# Altium schematic sheet Bopit_final2.SchDoc
size 420 x 297 mm; SheetNumber: 1; SheetTotal: 1
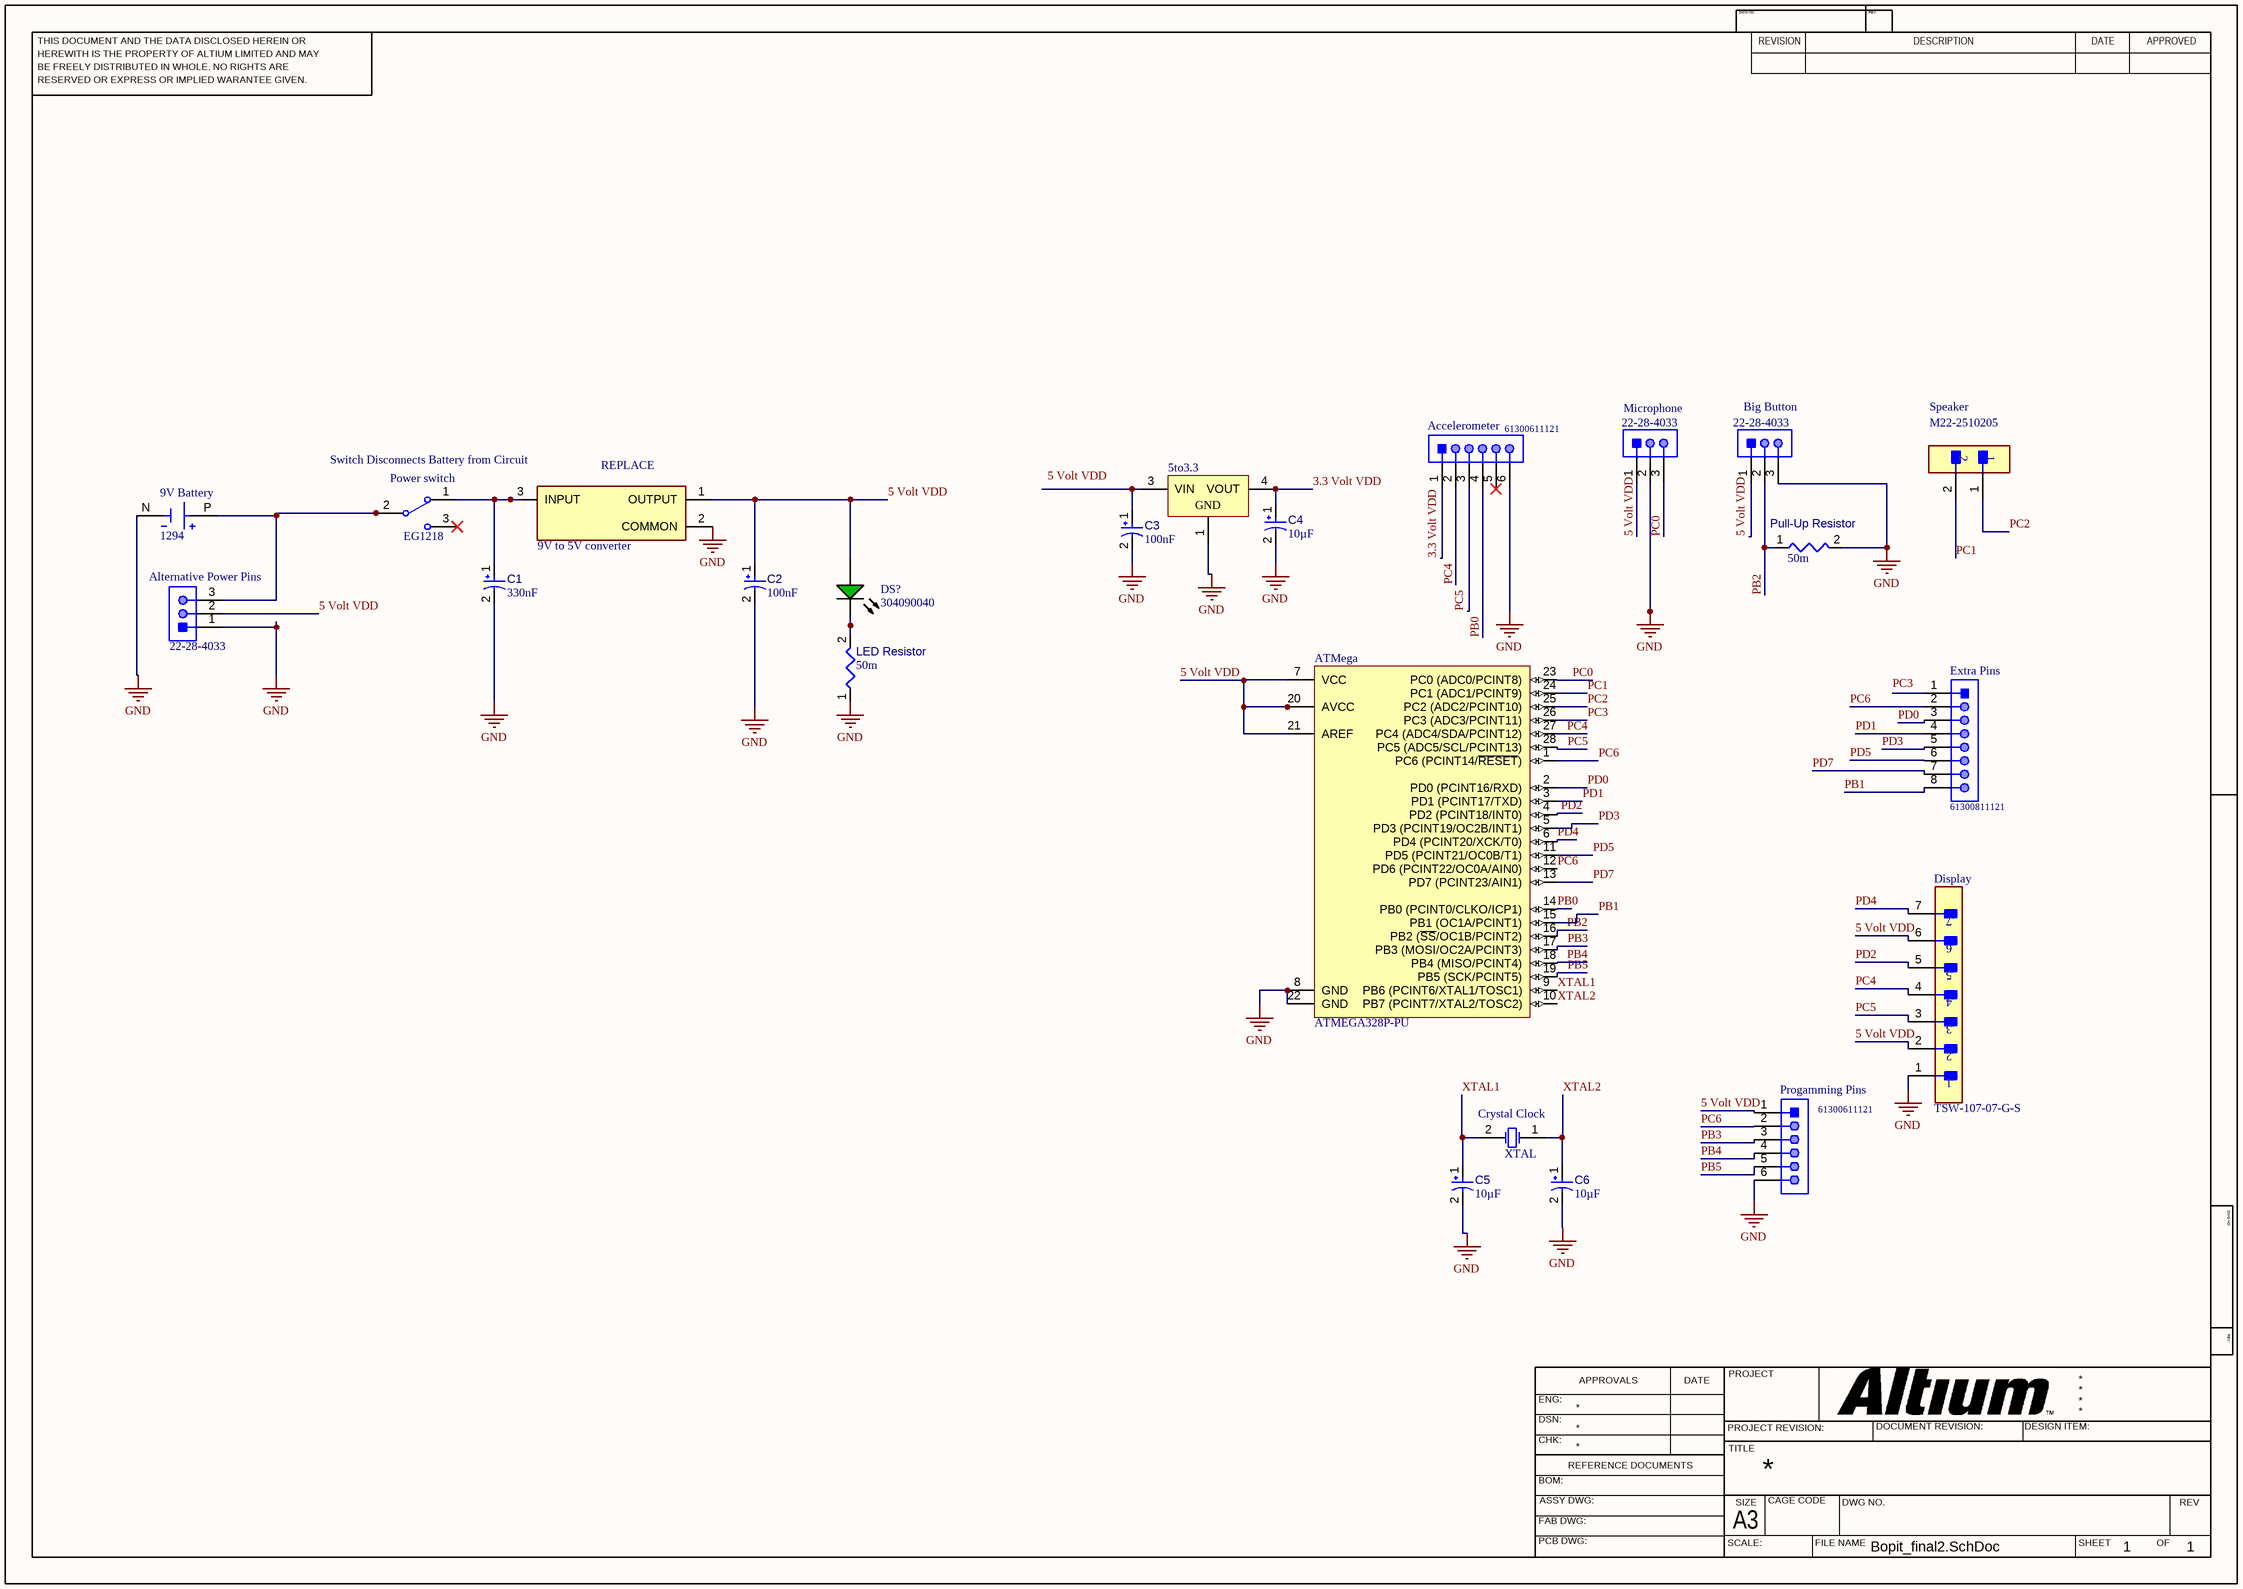
[diagram p0: Bopit_final2.SchDoc]

## Parts
5to3.3  LD1117DT33TR  [TO-252_N]  (value not drawn)
9V_Battery  1294  [BAT_1294]
9V_to_5V_converter  UA78L05CPK  [FP-PK0003A-MFG]  (value not drawn)
Accelerometer  61300611121  [61300611121]
Alternative_Power_Pins  22-28-4033  [MOLX-22-28-4033_V]
ATMega  ATMEGA328P-PU  [ATML-28P3]
Big_Button  22-28-4033  [MOLX-22-28-4033_V]
C1  value 330nF  [CAPPR55-200-1100X500X1200]  (hidden comment: ECA-1HHG010)
C2  value 100nF  [CAPPR55-200-1100X500X1200]  (hidden comment: ECA-1HHG010)
C3  value 100nF  [CAPPR55-200-1100X500X1200]  (hidden comment: ECA-1HHG010)
C4  value 10µF  [CAPPR55-200-1100X500X1200]  (hidden comment: ECA-1HHG010)
C5  value 10µF  [CAPPR55-200-1100X500X1200]  (hidden comment: ECA-1HHG010)
C6  value 10µF  [CAPPR55-200-1100X500X1200]  (hidden comment: ECA-1HHG010)
Crystal_Clock  XTAL  [R38]
Display  TSW-107-07-G-S  [FP-TSW-107-07-G-S-MFG]
DS?  304090040  [LED-2P-2.28-3MM]
Extra_Pins  61300811121  [61300811121]
LED_Resistor  value 50m  [RESA86-1060X240]  (hidden comment: 12FR050E)
Microphone  22-28-4033  [MOLX-22-28-4033_V]
Power_switch  EG1218  [ESWI-EG1218_V]
Progamming_Pins  61300611121  [61300611121]
Pull-Up_Resistor  value 50m  [RESA86-1060X240]  (hidden comment: 12FR050E)
Speaker  M22-2510205  [FP-M22-2510205-MFG]

## Nets
GND: 5to3.3.1(GND) 9V_Battery.N(NEG) 9V_to_5V_converter.2(COMMON) Accelerometer.6 Alternative_Power_Pins.1 ATMega.8(GND) ATMega.22(GND) Big_Button.3 C1.2 C2.2 C3.2 C4.2 C5.2 C6.2 Display.1 LED_Resistor.1 Microphone.2 Progamming_Pins.6 Pull-Up_Resistor.2
3.3 Volt VDD: 5to3.3.4(VOUT) Accelerometer.1 C4.1
5 Volt VDD: 9V_to_5V_converter.1(OUTPUT) Alternative_Power_Pins.2 ATMega.7(VCC) ATMega.20(AVCC) ATMega.21(AREF) Big_Button.1 C2.1 Display.2 Display.6 DS?.1(A) Microphone.1 Progamming_Pins.1
PB0: Accelerometer.4 ATMega.14(PB0_(PCINT0/CLKO/ICP1))
PB1: ATMega.15(PB1_(OC1A/PCINT1)) Extra_Pins.8
PB2: ATMega.16(PB2_(~{SS}/OC1B/PCINT2)) Big_Button.2 Pull-Up_Resistor.1
PB3: ATMega.17(PB3_(MOSI/OC2A/PCINT3)) Progamming_Pins.3
PB4: ATMega.18(PB4_(MISO/PCINT4)) Progamming_Pins.4
PB5: ATMega.19(PB5_(SCK/PCINT5)) Progamming_Pins.5
PC0: ATMega.23(PC0_(ADC0/PCINT8)) Microphone.3
PC1: ATMega.24(PC1_(ADC1/PCINT9)) Speaker.2
PC2: ATMega.25(PC2_(ADC2/PCINT10)) Speaker.1
PC3: ATMega.26(PC3_(ADC3/PCINT11))
PC4: Accelerometer.2 ATMega.27(PC4_(ADC4/SDA/PCINT12)) Display.4
PC5: Accelerometer.3 ATMega.28(PC5_(ADC5/SCL/PCINT13)) Display.3
PC6: ATMega.1(PC6_(PCINT14/~{RESET})) ATMega.12(PD6_(PCINT22/OC0A/AIN0)) Extra_Pins.2 Progamming_Pins.2
PD0: ATMega.2(PD0_(PCINT16/RXD)) Extra_Pins.3
PD1: ATMega.3(PD1_(PCINT17/TXD)) Extra_Pins.4
PD2: ATMega.4(PD2_(PCINT18/INT0)) Display.5
PD3: ATMega.5(PD3_(PCINT19/OC2B/INT1)) Extra_Pins.5
PD4: ATMega.6(PD4_(PCINT20/XCK/T0)) Display.7
PD5: ATMega.11(PD5_(PCINT21/OC0B/T1)) Extra_Pins.6
PD7: ATMega.13(PD7_(PCINT23/AIN1)) Extra_Pins.7
XTAL1: ATMega.9(PB6_(PCINT6/XTAL1/TOSC1)) C5.1 Crystal_Clock.2(OSC2)
XTAL2: ATMega.10(PB7_(PCINT7/XTAL2/TOSC2)) C6.1 Crystal_Clock.1(OSC1)
Net5to3.3_3: 5to3.3.3(VIN) C3.1
Net9V_Battery_P: 9V_Battery.P(POS) Alternative_Power_Pins.3 Power_switch.2(COM)
Net9V_to_5V_converter_3: 9V_to_5V_converter.3(INPUT) C1.1 Power_switch.1
NetDS?_2: DS?.2(K) LED_Resistor.2

Not connected (* = marked no-connect by the designer): Accelerometer 5*; Extra_Pins 1; Power_switch 3*

## Notes on the sheet
- Switch Disconnects Battery from Circuit
- (near 9V_to_5V_converter) REPLACE
- Labels drawn without touching a wire or pin: 5 Volt VDD, PC3
- THIS DOCUMENT AND THE DATA DISCLOSED HEREIN OR
- HEREWITH IS THE PROPERTY OF ALTIUM LIMITED AND MAY
- DWG NO:
- REVISION
- REV:
- DESCRIPTION
- DATE
- APPROVED
- BE FREELY DISTRIBUTED IN WHOLE. NO RIGHTS ARE
- RESERVED OR EXPRESS OR IMPLIED WARANTEE GIVEN.
- ENG:
- APPROVALS
- PROJECT
- DSN:
- CHK:
- REFERENCE DOCUMENTS
- PROJECT REVISION:
- TITLE
- DOCUMENT REVISION:
- DESIGN ITEM:
- BOM:
- FAB DWG:
- PCB DWG:
- ASSY DWG:
- SCALE:
- A3
- SIZE
- CAGE CODE
- FILE NAME
- DWG NO.
- SHEET
- OF
- REV

## Library data of the parts
5to3.3 = CMP-0244-00088-1: Fixed Low Drop Positive Voltage Regulator, 3.3V, 3-Pin DPAK, Tape and Reel; ComponentLink1Description: Manufacturer URL; PackageVersion: 2011; PackageReference: TO-252; ComponentLink2Description: Datasheet; ComponentLink1URL: http://www.st.com; DatasheetVersion: 1/11/2011; PackageDescription: 3-Pin Transistor Outline Package 2.28 mm Pitch, 9.7 mm Lead Span (DPAK); ComponentLink2URL: http://www.st.com/internet/com/TECHNICAL_RESOURCES/TECHNICAL_LITERATURE/DATASHEET/CD00000544.pdf
9V_Battery = 1294: Battery Holder _Open_ 9V 1 Cell PC Pin; MF: Adafruit Industries; Availability: Unavailable; Value: *; Package: None; MP: 1294; Price: None; SnapEDA_Link: https://www.snapeda.com/parts/1294/Adafruit%20Industries/view-part/891197/?ref=snap
9V_to_5V_converter = CMP-2000-07341-2: IC REG LINEAR 5V 100MA SOT89-3; Manufacturer: Texas Instruments; Min Supply Voltage: 7V; Accuracy Percentage: 3.75%; Dropout Voltage: 1.7V; Number Of Outputs: 1; Nominal Supply Current: 3.8mA; Max Supply Voltage: 20V; Output Type: Fixed; Max Junction Temp: +125°C; Digikey Description: IC REG LINEAR 5V 100MA SOT89-3; RoHS: TRUE; ComponentLink2URL: https://www.ti.com/lit/ds/symlink/ua78l.pdf; Package: PK0003A; Temperature Range High: +125°C; Device Class L2: Power Management ICs; Manufacturer Part Number: UA78L05CPK; ComponentLink2Description: Datasheet; Category: IC; Lead Free: Yes; Automotive: No; Temperature Range Low: 0°C; Output Current: 100mA; Mouser Description: 100-mA, 30-V VIN, Positive-Voltage Linear Regulators 3-SOT-89 0 to 125; Device Class L3: Voltage Regulators - Linear; Device Class L1: Integrated Circuits (ICs); Temperature: 0°C to +125°C; Output Voltage: 5V; Height: 1.6mm; Octopart: https://octopart.com/ua78l05cpk-texas+instruments-525289
Accelerometer Progamming_Pins = CMP-1502-01070-1: THT Vertical Pin Header WR-PHD, Pitch 2.54 mm, Single Row, 6 pins; Manufacturer: Wurth Elektronik; Gender: Male; Pin Number: 6; Pitch: 2.54mm; Working Voltage: 250VAC; Rated Current: 3A; Withstanding Voltage: 500VAC; Contact Resistance: 20mOhm; Operating Temperature: -40to105degC; Packaging: Bag; Datasheet URL: https://katalog.we-online.de/em/datasheet/6130xx11121.pdf; Package Reference: 61300611121; Mounting Technology: THT; Publisher: WurthElektronik; Part Number: 61300611121; Manufacturer URL: http://www.we-online.de; Row Number: Single; Orientation: Vertical
Alternative_Power_Pins Big_Button Microphone = CMP-1676-00001-5: Male Header, Pitch 2.54 mm, 1 x 3 Position, Height 8.38 mm, Tail Length 3.18 mm, RoHS, Bulk; Manufacturer: Molex; Rows: 1; Voltage Rating: 250 V; Current Rating: 4 A; Min Operating Temperature: 0 degC; Lead Pitch: 0.1 inch; Packaging: Bulk; Contact Finish: Gold; RoHSCompliant: true; Contact Material: Brass; PackageReference: 22-28-4033; REACH SVHC: Unknown; PackageDescription: Male Header, Pitch 2.54 mm, 1 x 3 Position, Height 8.38 mm, Tail Length 3.18 mm; ComponentLink2URL: http://www.molex.com/pdm_docs/sd/022284033_sd.pdf; Height: 8.38 mm; Mounting Technology: Through Hole; ComponentLink1Description: Manufacturer URL; Length: 7.62 mm; Mount: Through Hole; DatasheetVersion: Rev. G, 01/2012; Max Operating Temperature: 75 degC; ComponentLink2Description: Datasheet; Colour: Black; Pins: 3; Contact Plating: Gold; Package Quantity: 1; ComponentLink1URL: http://www.molex.com/
ATMega = CMP-020-00004-2: 8-Bit Microcontroller with 32 KBytes In-System Programmable Flash, 23 I/Os, -40 to 85 degC, 28-Pin PDIP (28P3), RoHS, Tube; Manufacturer: Atmel; Max Supply Voltage: 5.5V; Density: 32KB; Package Version: Rev. B, 09/2001; Max Clock Frequency: 20MHz; I/Os: 23; Ethernet Channels: 0; Min Supply Voltage: 1.8V; RAM Size: 2KB; Interface: USART; Case/Package: DIP; Packaging: Rail/Tube; Datasheet Version: Rev. 8271J, 11/2015; Max Operating Temperature: 85°C; Datasheet URL: http://www.atmel.com/images/Atmel-8271-8-bit-AVR-Microcontroller-ATmega48A-48PA-88A-88PA-168A-168PA-328-328P_datasheet_Complete.pdf; Package Reference: 28P3; Package URL: http://www.atmel.com/images/Atmel-8271-8-bit-AVR-Microcontroller-ATmega48A-48PA-88A-88PA-168A-168PA-328-328P_datasheet_Complete.pdf; Min Operating Temperature: -40°C; Manufacturer URL: http://www.atmel.com/; Package Description: 28-Pin Plastic Dual Inline Package, Body 34.671 x 7.3025 mm, Pitch 2.54 mm; Pins: 28; Package Quantity: 14; RoHS Compliant: True; Mounting Technology: TH
C1-C6 = CMP-001-00024-5: Aluminum Electrolytic Capacitor, 1 uF, +/- 20%, 50 V, -55 to 105 degC, 2-Pin THD, RoHS, Bulk; Manufacturer: Panasonic; Voltage Rating: 50V; Ripple Current: 10mA; Datasheet URL: https://datasheet.ciiva.com/7275/94060-7275472.pdf; Min Operating Temperature: -55°C; Case/Package: Radial; Package Reference: CAPPR55-200-1100X500X1200; Pins: 2; Lead Pitch: 2mm; Max Operating Temperature: 105°C; Diameter: 5mm; Capacitor Type: Electrolytic; Mounting Technology: TH; Datasheet Version: Mar-05; Package Description: 2-Pin Radial Lead, Dia 5 mm, Height 12 mm; Ripple Current (AC): 10mA; RoHS Compliant: True; Packaging: Bulk; Package Quantity: 200; Manufacturer URL: http://www.panasonic.com/; Tolerance: 20%
Crystal_Clock = XTAL: Crystal Oscillator; Published: 8-Jun-2000; LatestRevisionDate: 17-Jul-2002; LatestRevisionNote: Re-released for DXP Platform.; PackageReference: R38; Publisher: Altium Limited; PackageDescription: Crystal, Thru-Hole; 2 Leads; Body 3.1 x 8.2 mm (Dia.xH)
Display = CMP-02766-000065-1: CONN HEADER VERT 7POS 2.54MM; Manufacturer: SAMTEC; Conn Orientation: Straight; Number Of Contacts: 7; Conn Gender: Male; Lead Free: Yes; Automotive: No; Temperature Range High: +125°C; Pitch: 2.54mm; Footprint Url: http://suddendocs.samtec.com/prints/tsw-xxx-xx-x-x-xx-xxx-footprint.pdf; Device Class L1: Connectors; Contact Material: Gold,Nickel; RoHS: TRUE; ComponentLink2URL: http://suddendocs.samtec.com/prints/tsw-xxx-xx-xxx-x-xx-xxx-mkt.pdf; Manufacturer Part Number: TSW-107-07-G-S; Octopart: https://octopart.com/tsw-107-07-g-s-samtec-272202; Digikey Description: CONN HEADER VERT 7POS 2.54MM; Number Of Rows: 1; Temperature Range Low: -55°C; Device Class L2: Headers and Wire Housings; ComponentLink2Description: Datasheet; Category: Conn; Device Class L3: unset; Mouser Description: Conn Unshrouded Header HDR 7 POS 2.54mm Solder ST Thru-Hole Automotive Bulk; Temperature: -55°C to +125°C; Height: 8.71mm; Package: 0
DS? = CMP-007-00006-1: Green LED, 80 mW, 20 mA, -25 to 85 degC, 2-Pin THD; Manufacturer: Shenzhen CGX; Mounting Technology: TH; Case/Package: 304090040; Package Description: 2-Pin Through Hole Device, Dia 3 mm, Pitch 2.28 mm; RoHS Compliant: Unknown; Package Reference: 304090040; Datasheet Version: Rev. 1.0, 09/2014; Manufacturer URL: http://szcgx.com/; Datasheet URL: http://datasheet.octopart.com/304090040-Chengguangxing-datasheet-62330655.pdf
Extra_Pins = CMP-1502-01076-1: THT Vertical Pin Header WR-PHD, Pitch 2.54 mm, Single Row, 8 pins; Manufacturer: Wurth Elektronik; Rated Current: 3A; Pin Number: 8; Working Voltage: 250VAC; Gender: Male; Contact Resistance: 20mOhm; Pitch: 2.54mm; Withstanding Voltage: 500VAC; Publisher: WurthElektronik; Operating Temperature: -40to105degC; Orientation: Vertical; Row Number: Single; Part Number: 61300811121; Package Reference: 61300811121; Mounting Technology: THT; Packaging: Bag; Manufacturer URL: http://www.we-online.de; Datasheet URL: https://katalog.we-online.de/em/datasheet/6130xx11121.pdf
LED_Resistor Pull-Up_Resistor = CMP-009-00035-3: Axial Resistor, 50 mOhm, +/- 1%, 2 W, -55 to 275 degC, 2-Pin THD, RoHS, Bulk; Manufacturer: Ohmite; Voltage Rating: 100mV; Power: 2W; Datasheet Version: Jun-15; Manufacturer URL: http://www.ohmite.com/; Diameter: 2.4mm; Pins: 2; RoHS Compliant: True; Case/Package: Axial; Package Quantity: 10; Mounting Technology: TH; Datasheet URL: http://www.ohmite.com/cat/res_10.pdf; Packaging: Bulk; Min Operating Temperature: -55°C; Package Description: 2-Pin Axial Lead, Dia 2.4 mm, Body Length 10.6 mm; Max Operating Temperature: 275°C; Tolerance: 1%; Package Reference: 12FR050E; Composition: Wirewound
Power_switch = CMP-1696-00002-1: Slide Switch, 500 V, -20 to 70 degC, 3-Pin THD, RoHS; Case\Package: SOT-23-5; Output Current: 150 mA; Nominal Output Voltage: 3.3 V; Max Power Dissipation: 250 mW; Min Input Voltage: 4.3 V; Outputs: 1; Max Input Voltage: 8 V; Dropout Voltage: 300 mV; PackageDescription: 3-Pin Through Hole Device, Body 11.6 x 4 mm, Pitch 2.5 mm; ComponentLink1URL: http://www.e-switch.ch/en/; RoHSCompliant: true; Length: 3 mm; ComponentLink1Description: Manufacturer URL; Power Rating: 250 mW; Mount: Surface Mount; Max Operating Temperature: 85 degC; REACH SVHC: No SVHC; Radiation Hardening: No; Height: 1.3 mm; Pins: 5; Max Ouput Current: 150 mA; Output Voltage: 3.3 V; Width: 1.8 mm; Package Quantity: 3000; ComponentLink2URL: https://www.e-switch.com/system/asset/product_line/data_sheet/119/EG.pdf; Min Operating Temperature: -40 degC; ComponentLink2Description: Datasheet; DatasheetVersion: Oct-15; PackageReference: EG1218; Packaging: Tape and Reel
Speaker = CMP-15831-000005-1: CONN HEADER VERT 2POS 2MM; Manufacturer: Harwin; Conn Gender: Male; Current Rating: 2A; Number Of Contacts: 2; Conn Orientation: Vertical; Temperature Range Low: -40°C; Device Class L1: Connectors; ComponentLink2URL: https://cdn.harwin.com/pdfs/C018XX_M22_Series_Connectors.pdf; Temperature Range High: +105°C; Pitch: 2mm; Number Of Rows: 1; Temperature: -40°C to +105°C; Automotive: No; Device Class L3: unset; Octopart: https://octopart.com/m22-2510205-harwin-2538221; Mouser Description: Headers & Wire Housings 2 PIN SIL VERTICAL GOLD PIN HEADER; Height: 5.45mm; Category: Conn; Digikey Description: CONN HEADER VERT 2POS 2MM; Contact Material: Gold,Nickel; Lead Free: Yes; ComponentLink2Description: Datasheet; Manufacturer Part Number: M22-2510205; Device Class L2: Headers and Wire Housings; Package: 0; Footprint Url: https://cdn.harwin.com/pdfs/M22-251.pdf; RoHS: TRUE